# EAGLE schematic Keyboard (EAGLE 6.3)
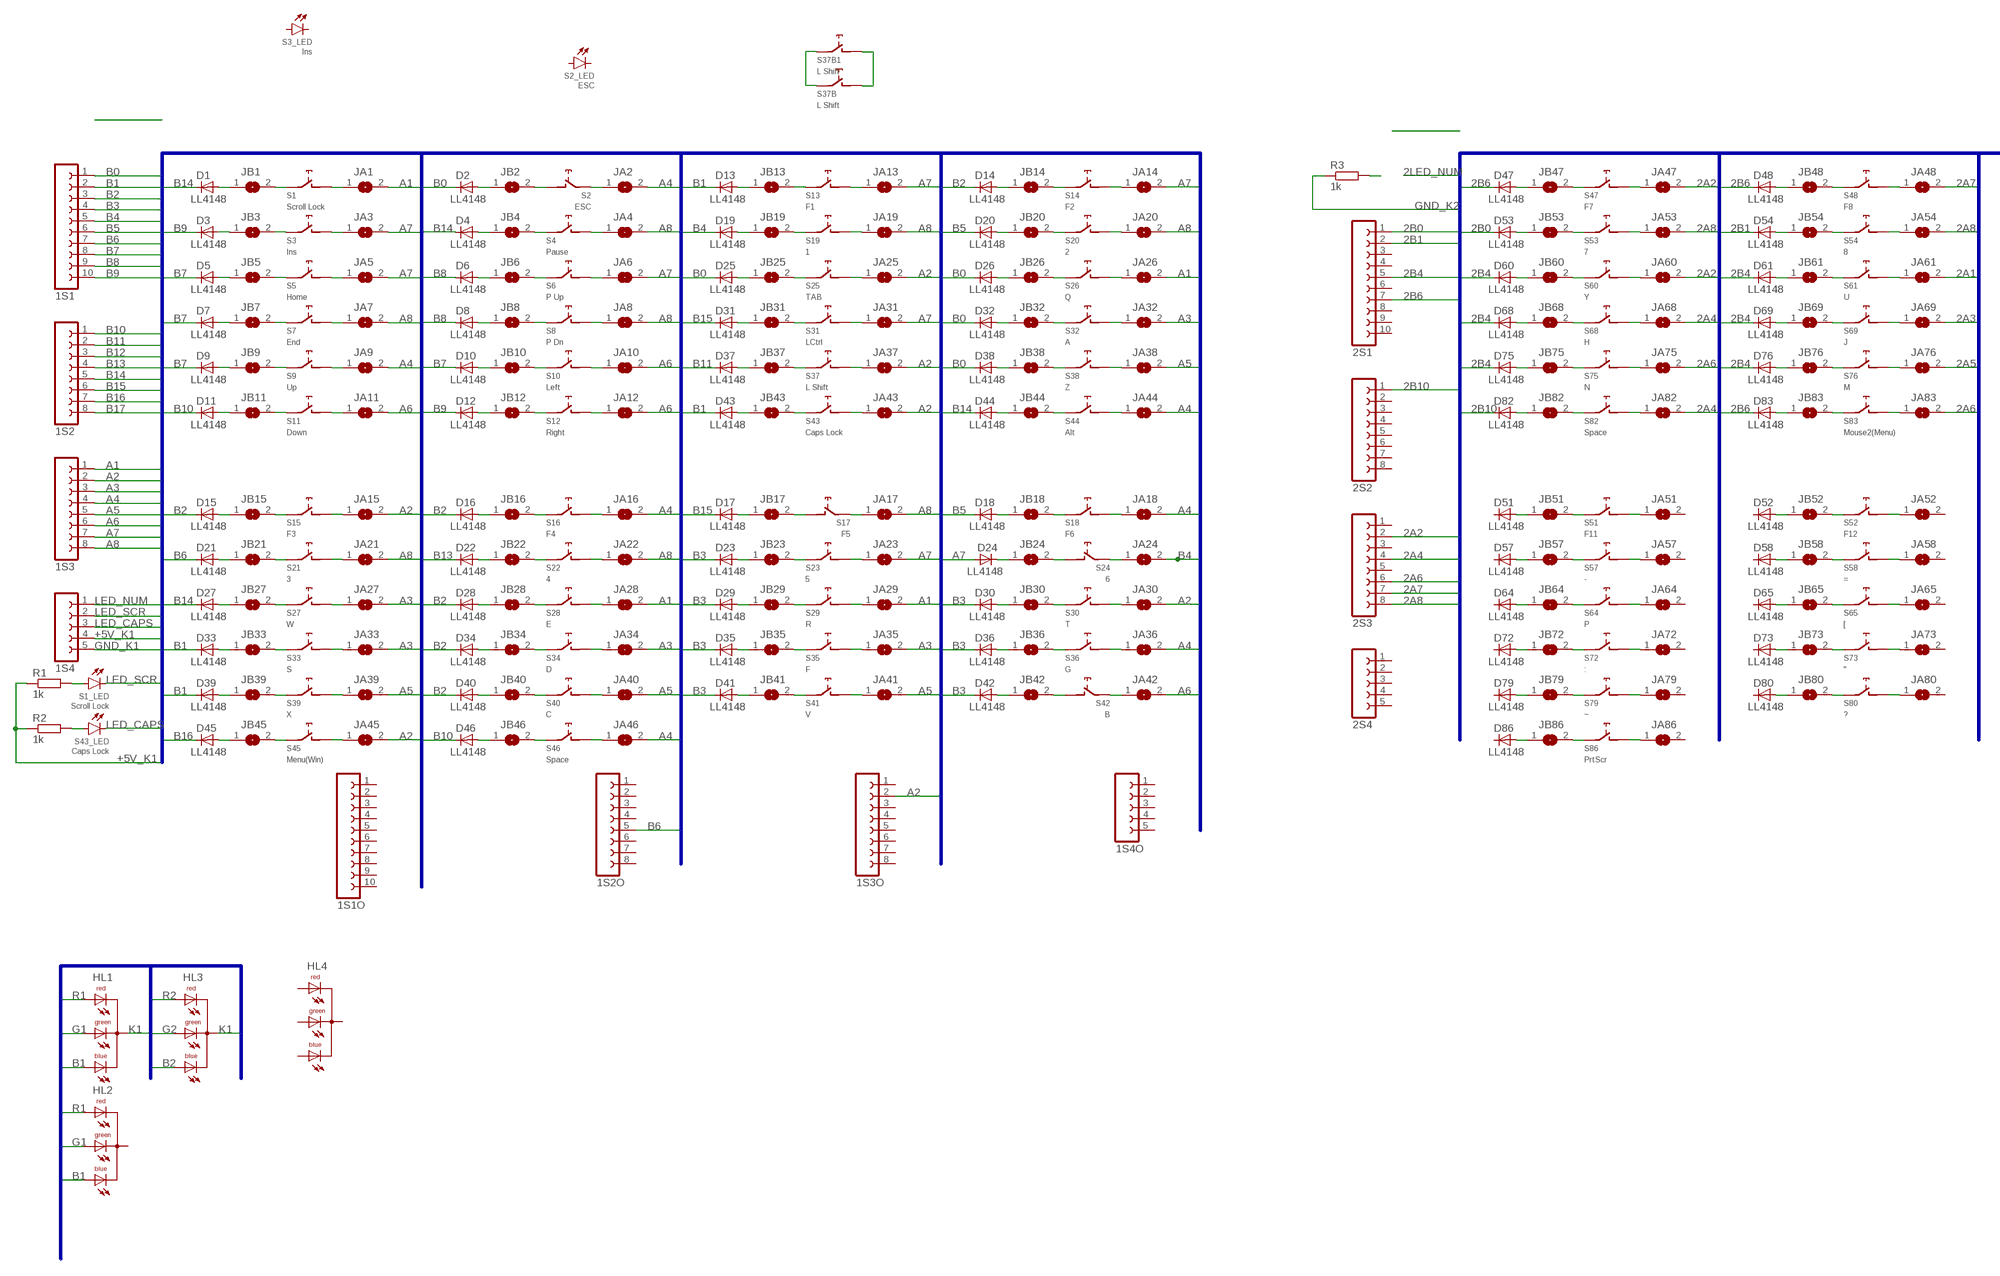
[diagram p0: schematic, sheet 1, part 1 of 2]
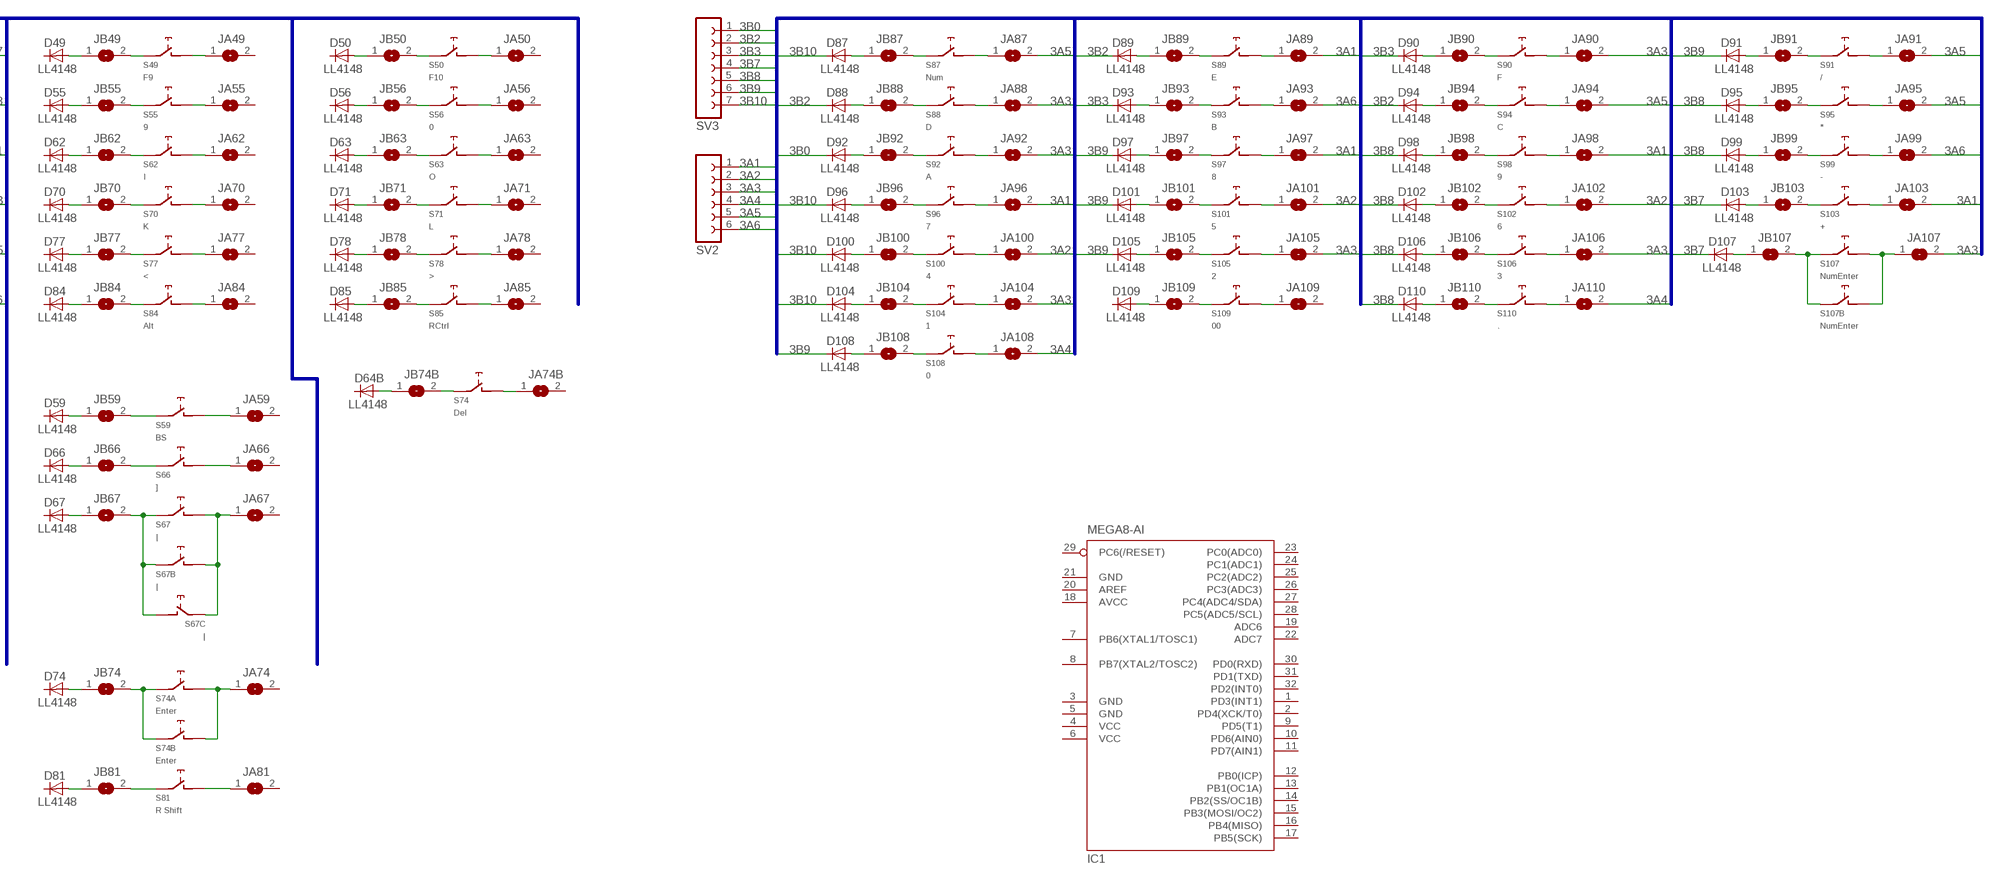
[diagram p1: schematic, sheet 1, part 2 of 2]

## Parts
1S1  FE10-1  [FE10]
1S1O  FE10-1  [FE10]
1S2  FE08-1  [FE08]
1S2O  FE08-1  [FE08]
1S3  FE08-1  [FE08]
1S3O  FE08-1  [FE08]
1S4  FE05-1  [FE05-1]
1S4O  FE05-1  [FE05-1]
2S1  FE10-1  [FE10]
2S2  FE08-1  [FE08]
2S3  FE08-1  [FE08]
2S4  FE05-1  [FE05-1]
D1  LL4148  [SOD80C]
D2  LL4148  [SOD80C]
D3  LL4148  [SOD80C]
D4  LL4148  [SOD80C]
D5  LL4148  [SOD80C]
D6  LL4148  [SOD80C]
D7  LL4148  [SOD80C]
D8  LL4148  [SOD80C]
D9  LL4148  [SOD80C]
D10  LL4148  [SOD80C]
D11  LL4148  [SOD80C]
D12  LL4148  [SOD80C]
D13  LL4148  [SOD80C]
D14  LL4148  [SOD80C]
D15  LL4148  [SOD80C]
D16  LL4148  [SOD80C]
D17  LL4148  [SOD80C]
D18  LL4148  [SOD80C]
D19  LL4148  [SOD80C]
D20  LL4148  [SOD80C]
D21  LL4148  [SOD80C]
D22  LL4148  [SOD80C]
D23  LL4148  [SOD80C]
D24  LL4148  [SOD80C]
D25  LL4148  [SOD80C]
D26  LL4148  [SOD80C]
D27  LL4148  [SOD80C]
D28  LL4148  [SOD80C]
D29  LL4148  [SOD80C]
D30  LL4148  [SOD80C]
D31  LL4148  [SOD80C]
D32  LL4148  [SOD80C]
D33  LL4148  [SOD80C]
D34  LL4148  [SOD80C]
D35  LL4148  [SOD80C]
D36  LL4148  [SOD80C]
D37  LL4148  [SOD80C]
D38  LL4148  [SOD80C]
D39  LL4148  [SOD80C]
D40  LL4148  [SOD80C]
D41  LL4148  [SOD80C]
D42  LL4148  [SOD80C]
D43  LL4148  [SOD80C]
D44  LL4148  [SOD80C]
D45  LL4148  [SOD80C]
D46  LL4148  [SOD80C]
D47  LL4148  [SOD80C]
D48  LL4148  [SOD80C]
D49  LL4148  [SOD80C]
D50  LL4148  [SOD80C]
D51  LL4148  [SOD80C]
D52  LL4148  [SOD80C]
D53  LL4148  [SOD80C]
D54  LL4148  [SOD80C]
D55  LL4148  [SOD80C]
D56  LL4148  [SOD80C]
D57  LL4148  [SOD80C]
D58  LL4148  [SOD80C]
D59  LL4148  [SOD80C]
D60  LL4148  [SOD80C]
D61  LL4148  [SOD80C]
D62  LL4148  [SOD80C]
D63  LL4148  [SOD80C]
D64  LL4148  [SOD80C]
D64B  LL4148  [SOD80C]
D65  LL4148  [SOD80C]
D66  LL4148  [SOD80C]
D67  LL4148  [SOD80C]
D68  LL4148  [SOD80C]
D69  LL4148  [SOD80C]
D70  LL4148  [SOD80C]
D71  LL4148  [SOD80C]
D72  LL4148  [SOD80C]
D73  LL4148  [SOD80C]
D74  LL4148  [SOD80C]
D75  LL4148  [SOD80C]
D76  LL4148  [SOD80C]
D77  LL4148  [SOD80C]
D78  LL4148  [SOD80C]
D79  LL4148  [SOD80C]
D80  LL4148  [SOD80C]
D81  LL4148  [SOD80C]
D82  LL4148  [SOD80C]
D83  LL4148  [SOD80C]
D84  LL4148  [SOD80C]
D85  LL4148  [SOD80C]
D86  LL4148  [SOD80C]
D87  LL4148  [SOD80C]
D88  LL4148  [SOD80C]
D89  LL4148  [SOD80C]
D90  LL4148  [SOD80C]
D91  LL4148  [SOD80C]
D92  LL4148  [SOD80C]
D93  LL4148  [SOD80C]
D94  LL4148  [SOD80C]
D95  LL4148  [SOD80C]
D96  LL4148  [SOD80C]
D97  LL4148  [SOD80C]
D98  LL4148  [SOD80C]
D99  LL4148  [SOD80C]
D100  LL4148  [SOD80C]
D101  LL4148  [SOD80C]
D102  LL4148  [SOD80C]
D103  LL4148  [SOD80C]
D104  LL4148  [SOD80C]
D105  LL4148  [SOD80C]
D106  LL4148  [SOD80C]
D107  LL4148  [SOD80C]
D108  LL4148  [SOD80C]
D109  LL4148  [SOD80C]
D110  LL4148  [SOD80C]
HL1  RGB2X5  [RGB2X5]
HL2  RGB2X5  [RGB2X5]
HL3  RGB2X5  [RGB2X5]
HL4  RGB2X5  [RGB2X5]
IC1  MEGA8-AI  [TQFP32-08]
JA1  SJ  [SJ@1]
JA2  SJ  [SJ@1]
JA3  SJ  [SJ@1]
JA4  SJ  [SJ@1]
JA5  SJ  [SJ@1]
JA6  SJ  [SJ@1]
JA7  SJ  [SJ@1]
JA8  SJ  [SJ@1]
JA9  SJ  [SJ@1]
JA10  SJ  [SJ@1]
JA11  SJ  [SJ@1]
JA12  SJ  [SJ@1]
JA13  SJ  [SJ]
JA14  SJ  [SJ]
JA15  SJ  [SJ]
JA16  SJ  [SJ]
JA17  SJ  [SJ]
JA18  SJ  [SJ]
JA19  SJ  [SJ]
JA20  SJ  [SJ]
JA21  SJ  [SJ]
JA22  SJ  [SJ]
JA23  SJ  [SJ]
JA24  SJ  [SJ]
JA25  SJ  [SJ]
JA26  SJ  [SJ]
JA27  SJ  [SJ]
JA28  SJ  [SJ]
JA29  SJ  [SJ]
JA30  SJ  [SJ]
JA31  SJ  [SJ]
JA32  SJ  [SJ]
JA33  SJ  [SJ]
JA34  SJ  [SJ]
JA35  SJ  [SJ]
JA36  SJ  [SJ]
JA37  SJ  [SJ]
JA38  SJ  [SJ]
JA39  SJ  [SJ]
JA40  SJ  [SJ]
JA41  SJ  [SJ]
JA42  SJ  [SJ]
JA43  SJ  [SJ]
JA44  SJ  [SJ]
JA45  SJ  [SJ]
JA46  SJ  [SJ]
JA47  SJ  [SJ]
JA48  SJ  [SJ]
JA49  SJ  [SJ]
JA50  SJ  [SJ]
JA51  SJ  [SJ]
JA52  SJ  [SJ]
JA53  SJ  [SJ]
JA54  SJ  [SJ]
JA55  SJ  [SJ]
JA56  SJ  [SJ]
JA57  SJ  [SJ]
JA58  SJ  [SJ]
JA59  SJ  [SJ]
JA60  SJ  [SJ]
JA61  SJ  [SJ]
JA62  SJ  [SJ]
JA63  SJ  [SJ]
JA64  SJ  [SJ]
JA65  SJ  [SJ]
JA66  SJ  [SJ]
JA67  SJ  [SJ]
JA68  SJ  [SJ]
JA69  SJ  [SJ]
JA70  SJ  [SJ]
JA71  SJ  [SJ]
JA72  SJ  [SJ]
JA73  SJ  [SJ]
JA74  SJ  [SJ]
JA74B  SJ  [SJ]
JA75  SJ  [SJ]
JA76  SJ  [SJ]
JA77  SJ  [SJ]
JA78  SJ  [SJ]
JA79  SJ  [SJ]
JA80  SJ  [SJ]
JA81  SJ  [SJ]
JA82  SJ  [SJ]
JA83  SJ  [SJ]
JA84  SJ  [SJ]
JA85  SJ  [SJ]
JA86  SJ  [SJ]
JA87  SJ  [SJ]
JA88  SJ  [SJ]
JA89  SJ  [SJ]
JA90  SJ  [SJ]
JA91  SJ  [SJ]
JA92  SJ  [SJ]
JA93  SJ  [SJ]
JA94  SJ  [SJ]
JA95  SJ  [SJ]
JA96  SJ  [SJ]
JA97  SJ  [SJ]
JA98  SJ  [SJ]
JA99  SJ  [SJ]
JA100  SJ  [SJ]
JA101  SJ  [SJ]
JA102  SJ  [SJ]
JA103  SJ  [SJ]
JA104  SJ  [SJ]
JA105  SJ  [SJ]
JA106  SJ  [SJ]
JA107  SJ  [SJ]
JA108  SJ  [SJ]
JA109  SJ  [SJ]
JA110  SJ  [SJ]
JB1  SJ  [SJ]
JB2  SJ  [SJ@1]
JB3  SJ  [SJ]
JB4  SJ  [SJ@1]
JB5  SJ  [SJ@1]
JB6  SJ  [SJ@1]
JB7  SJ  [SJ@1]
JB8  SJ  [SJ@1]
JB9  SJ  [SJ@1]
JB10  SJ  [SJ@1]
JB11  SJ  [SJ@1]
JB12  SJ  [SJ@1]
JB13  SJ  [SJ@1]
JB14  SJ  [SJ@1]
JB15  SJ  [SJ@1]
JB16  SJ  [SJ@1]
JB17  SJ  [SJ@1]
JB18  SJ  [SJ]
JB19  SJ  [SJ]
JB20  SJ  [SJ]
JB21  SJ  [SJ]
JB22  SJ  [SJ]
JB23  SJ  [SJ]
JB24  SJ  [SJ]
JB25  SJ  [SJ]
JB26  SJ  [SJ]
JB27  SJ  [SJ]
JB28  SJ  [SJ]
JB29  SJ  [SJ]
JB30  SJ  [SJ]
JB31  SJ  [SJ]
JB32  SJ  [SJ]
JB33  SJ  [SJ]
JB34  SJ  [SJ]
JB35  SJ  [SJ]
JB36  SJ  [SJ]
JB37  SJ  [SJ]
JB38  SJ  [SJ]
JB39  SJ  [SJ]
JB40  SJ  [SJ]
JB41  SJ  [SJ]
JB42  SJ  [SJ]
JB43  SJ  [SJ]
JB44  SJ  [SJ]
JB45  SJ  [SJ]
JB46  SJ  [SJ]
JB47  SJ  [SJ]
JB48  SJ  [SJ]
JB49  SJ  [SJ]
JB50  SJ  [SJ]
JB51  SJ  [SJ]
JB52  SJ  [SJ]
JB53  SJ  [SJ]
JB54  SJ  [SJ]
JB55  SJ  [SJ]
JB56  SJ  [SJ]
JB57  SJ  [SJ]
JB58  SJ  [SJ]
JB59  SJ  [SJ]
JB60  SJ  [SJ]
JB61  SJ  [SJ]
JB62  SJ  [SJ]
JB63  SJ  [SJ]
JB64  SJ  [SJ]
JB65  SJ  [SJ]
JB66  SJ  [SJ]
JB67  SJ  [SJ]
JB68  SJ  [SJ]
JB69  SJ  [SJ]
JB70  SJ  [SJ]
JB71  SJ  [SJ]
JB72  SJ  [SJ]
JB73  SJ  [SJ]
JB74  SJ  [SJ]
JB74B  SJ  [SJ]
JB75  SJ  [SJ]
JB76  SJ  [SJ]
JB77  SJ  [SJ]
JB78  SJ  [SJ]
JB79  SJ  [SJ]
JB80  SJ  [SJ]
JB81  SJ  [SJ]
JB82  SJ  [SJ]
JB83  SJ  [SJ]
JB84  SJ  [SJ]
JB85  SJ  [SJ]
JB86  SJ  [SJ]
JB87  SJ  [SJ]
JB88  SJ  [SJ]
JB89  SJ  [SJ]
JB90  SJ  [SJ]
JB91  SJ  [SJ]
JB92  SJ  [SJ]
JB93  SJ  [SJ]
JB94  SJ  [SJ]
JB95  SJ  [SJ]
JB96  SJ  [SJ]
JB97  SJ  [SJ]
JB98  SJ  [SJ]
JB99  SJ  [SJ]
JB100  SJ  [SJ]
JB101  SJ  [SJ]
JB102  SJ  [SJ]
JB103  SJ  [SJ]
JB104  SJ  [SJ]
JB105  SJ  [SJ]
JB106  SJ  [SJ]
JB107  SJ  [SJ]
JB108  SJ  [SJ]
JB109  SJ  [SJ]
JB110  SJ  [SJ]
R1  1k  R-EU_R1206W  [R1206W]
R2  1k  R-EU_R1206W  [R1206W]
R3  1k  R-EU_R0805  [R0805]
S1  Scroll Lock  CHERRY-MX-LED  [CHERRY-MX-LED]
S2  ESC  CHERRY-MX-LED  [CHERRY-MX-LED]
S3  Ins  CHERRY-MX-LED  [CHERRY-MX-LED]
S4  Pause  CHERRY_MX  [CHERRY-MX@1]
S5  Home  CHERRY-MX  [CHERRY-MX]
S6  P Up  CHERRY-MX  [CHERRY-MX]
S7  End  CHERRY-MX  [CHERRY-MX]
S8  P Dn  CHERRY-MX  [CHERRY-MX]
S9  Up  CHERRY-MX  [CHERRY-MX]
S10  Left  CHERRY-MX  [CHERRY-MX]
S11  Down  CHERRY-MX  [CHERRY-MX]
S12  Right  CHERRY-MX  [CHERRY-MX]
S13  F1  CHERRY-MX  [CHERRY-MX]
S14  F2  CHERRY-MX  [CHERRY-MX]
S15  F3  CHERRY-MX  [CHERRY-MX]
S16  F4  CHERRY-MX  [CHERRY-MX]
S17  F5  CHERRY-MX  [CHERRY-MX]
S18  F6  CHERRY-MX  [CHERRY-MX]
S19  1  CHERRY-MX  [CHERRY-MX]
S20  2  CHERRY-MX  [CHERRY-MX]
S21  3  CHERRY-MX  [CHERRY-MX]
S22  4  CHERRY-MX  [CHERRY-MX]
S23  5  CHERRY-MX  [CHERRY-MX]
S24  6  CHERRY-MX  [CHERRY-MX]
S25  TAB  CHERRY-MX  [CHERRY-MX]
S26  Q  CHERRY-MX  [CHERRY-MX]
S27  W  CHERRY_MX  [CHERRY-MX@1]
S28  E  CHERRY-MX  [CHERRY-MX]
S29  R  CHERRY-MX  [CHERRY-MX]
S30  T  CHERRY-MX  [CHERRY-MX]
S31  LCtrl  CHERRY-MX  [CHERRY-MX]
S32  A  CHERRY-MX  [CHERRY-MX]
S33  S  CHERRY-MX  [CHERRY-MX]
S34  D  CHERRY-MX  [CHERRY-MX]
S35  F  CHERRY-MX  [CHERRY-MX]
S36  G  CHERRY-MX  [CHERRY-MX]
S37  L Shift  CHERRY-MX  [CHERRY-MX]
S37B  L Shift  CHERRY-MX  [CHERRY-MX]
S37B1  L Shift  CHERRY-MX  [CHERRY-MX]
S38  Z  CHERRY-MX  [CHERRY-MX]
S39  X  CHERRY-MX  [CHERRY-MX]
S40  C  CHERRY-MX  [CHERRY-MX]
S41  V  CHERRY-MX  [CHERRY-MX]
S42  B  CHERRY-MX  [CHERRY-MX]
S43  Caps Lock  CHERRY-MX-LED  [CHERRY-MX-LED]
S44  Alt  CHERRY-MX  [CHERRY-MX]
S45  Menu(Win)  CHERRY-MX  [CHERRY-MX]
S46  Space  CHERRY-MX  [CHERRY-MX]
S47  F7  CHERRY-MX  [CHERRY-MX]
S48  F8  CHERRY-MX  [CHERRY-MX]
S49  F9  CHERRY-MX  [CHERRY-MX]
S50  F10  CHERRY-MX  [CHERRY-MX]
S51  F11  CHERRY-MX  [CHERRY-MX]
S52  F12  CHERRY-MX  [CHERRY-MX]
S53  7  CHERRY-MX  [CHERRY-MX]
S54  8  CHERRY-MX  [CHERRY-MX]
S55  9  CHERRY-MX  [CHERRY-MX]
S56  0  CHERRY-MX  [CHERRY-MX]
S57  -  CHERRY-MX  [CHERRY-MX]
S58  =  CHERRY-MX  [CHERRY-MX]
S59  BS  CHERRY-MX  [CHERRY-MX]
S60  Y  CHERRY-MX  [CHERRY-MX]
S61  U  CHERRY-MX  [CHERRY-MX]
S62  I  CHERRY-MX  [CHERRY-MX]
S63  O  CHERRY-MX  [CHERRY-MX]
S64  P  CHERRY-MX  [CHERRY-MX]
S65  [  CHERRY-MX  [CHERRY-MX]
S66  ]  CHERRY-MX  [CHERRY-MX]
S67  |  CHERRY-MX  [CHERRY-MX]
S67B  |  CHERRY-MX  [CHERRY-MX]
S67C  |  CHERRY-MX  [CHERRY-MX]
S68  H  CHERRY-MX  [CHERRY-MX]
S69  J  CHERRY-MX  [CHERRY-MX]
S70  K  CHERRY-MX  [CHERRY-MX]
S71  L  CHERRY-MX  [CHERRY-MX]
S72  :  CHERRY-MX  [CHERRY-MX]
S73  "  CHERRY-MX  [CHERRY-MX]
S74  Del  CHERRY-MX  [CHERRY-MX]
S74A  Enter  CHERRY-MX  [CHERRY-MX]
S74B  Enter  CHERRY-MX  [CHERRY-MX]
S75  N  CHERRY-MX  [CHERRY-MX]
S76  M  CHERRY-MX  [CHERRY-MX]
S77  <  CHERRY-MX  [CHERRY-MX]
S78  >  CHERRY-MX  [CHERRY-MX]
S79  ~  CHERRY-MX  [CHERRY-MX]
S80  ?  CHERRY-MX  [CHERRY-MX]
S81  R Shift  CHERRY-MX  [CHERRY-MX]
S82  Space  CHERRY-MX  [CHERRY-MX]
S83  Mouse2(Menu)  CHERRY-MX  [CHERRY-MX]
S84  Alt  CHERRY-MX  [CHERRY-MX]
S85  RCtrl  CHERRY-MX  [CHERRY-MX]
S86  PrtScr  CHERRY-MX  [CHERRY-MX]
S87  Num  CHERRY-MX-4P  [CHERRY-MX-4P]
S88  D  CHERRY-MX-4P  [CHERRY-MX-4P]
S89  E  CHERRY-MX-4P  [CHERRY-MX-4P]
S90  F  CHERRY-MX-4P  [CHERRY-MX-4P]
S91  /  CHERRY-MX-4P  [CHERRY-MX-4P]
S92  A  CHERRY-MX-4P  [CHERRY-MX-4P]
S93  B  CHERRY-MX-4P  [CHERRY-MX-4P]
S94  C  CHERRY-MX-4P  [CHERRY-MX-4P]
S95  *  CHERRY-MX-4P  [CHERRY-MX-4P]
S96  7  CHERRY-MX-4P  [CHERRY-MX-4P]
S97  8  CHERRY-MX-4P  [CHERRY-MX-4P]
S98  9  CHERRY-MX-4P  [CHERRY-MX-4P]
S99  -  CHERRY-MX-4P  [CHERRY-MX-4P]
S100  4  CHERRY-MX-4P  [CHERRY-MX-4P]
S101  5  CHERRY-MX-4P  [CHERRY-MX-4P]
S102  6  CHERRY-MX-4P  [CHERRY-MX-4P]
S103  +  CHERRY-MX-4P  [CHERRY-MX-4P]
S104  1  CHERRY-MX-4P  [CHERRY-MX-4P]
S105  2  CHERRY-MX-4P  [CHERRY-MX-4P]
S106  3  CHERRY-MX-4P  [CHERRY-MX-4P]
S107  NumEnter  CHERRY-MX-4P  [CHERRY-MX-4P]
S107B  NumEnter  CHERRY-MX  [CHERRY-MX]
S108  0  CHERRY-MX-4P  [CHERRY-MX-4P]
S109  00  CHERRY-MX-4P  [CHERRY-MX-4P]
S110  .  CHERRY-MX-4P  [CHERRY-MX-4P]
SV2  FE06-1  [FE06]
SV3  FE07-1  [FE07]

## Nets
2A1: JA61.2
2A2: 2S3.2 JA47.2 JA60.2
2A3: JA69.2
2A4: 2S3.4 JA68.2 JA82.2
2A5: JA76.2
2A6: 2S3.6 JA75.2 JA83.2
2A7: 2S3.7 JA48.2
2A8: 2S3.8 JA53.2 JA54.2
2B0: 2S1.1 D53.C
2B1: 2S1.2 D54.C
2B4: 2S1.5 D60.C D61.C D68.C D69.C D75.C D76.C
2B6: 2S1.7 D47.C D48.C D83.C
2B10: 2S2.1 D82.C
3A1: JA89.2 JA96.2 JA97.2 JA98.2 JA103.2 SV2.1
3A2: JA100.2 JA101.2 JA102.2 SV2.2
3A3: JA88.2 JA90.2 JA92.2 JA104.2 JA105.2 JA106.2 JA107.2 SV2.3
3A4: JA108.2 JA110.2 SV2.4
3A5: JA87.2 JA91.2 JA94.2 JA95.2 SV2.5
3A6: JA93.2 JA99.2 SV2.6
3B0: D92.C SV3.1
3B2: D88.C D89.C D94.C SV3.2
3B3: D90.C D93.C SV3.3
3B7: D103.C D107.C SV3.4
3B8: D95.C D98.C D99.C D102.C D106.C D110.C SV3.5
3B9: D91.C D97.C D101.C D105.C D108.C SV3.6
3B10: D87.C D96.C D100.C D104.C SV3.7
+5V_K1: 1S4.4 R1.1 R2.1
A1: 1S3.1 JA1.2 JA26.2 JA28.2 JA29.2
A2: 1S3.2 1S3O.2 JA15.2 JA25.2 JA30.2 JA37.2 JA43.2 JA45.2
A3: 1S3.3 JA27.2 JA32.2 JA33.2 JA34.2 JA35.2
A4: 1S3.4 JA2.2 JA9.2 JA16.2 JA18.2 JA36.2 JA44.2 JA46.2
A5: 1S3.5 JA38.2 JA39.2 JA40.2 JA41.2
A6: 1S3.6 JA10.2 JA11.2 JA12.2 JA42.2
A7: 1S3.7 D24.A JA3.2 JA5.2 JA6.2 JA13.2 JA14.2 JA23.2 JA31.2
A8: 1S3.8 JA4.2 JA7.2 JA8.2 JA17.2 JA19.2 JA20.2 JA21.2 JA22.2
B0: 1S1.1 D2.C D25.C D26.C D32.C D38.C
B1: 1S1.2 D13.C D33.C D39.C D43.C HL1.4(AB) HL2.4(AB)
B2: 1S1.3 D14.C D15.C D16.C D28.C D34.C D40.C HL3.4(AB)
B3: 1S1.4 D23.C D29.C D30.C D35.C D36.C D41.C D42.C
B4: 1S1.5 D19.C JA24.2
B5: 1S1.6 D18.C D20.C
B6: 1S1.7 1S2O.5 D21.C
B7: 1S1.8 D5.C D7.C D9.C D10.C
B8: 1S1.9 D6.C D8.C
B9: 1S1.10 D3.C D12.C
B10: 1S2.1 D11.C D46.C
B11: 1S2.2 D37.C
B12: 1S2.3
B13: 1S2.4 D22.C
B14: 1S2.5 D1.C D4.C D27.C D44.C
B15: 1S2.6 D17.C D31.C
B16: 1S2.7 D45.C
B17: 1S2.8
G1: HL1.3(AG) HL2.3(AG)
G2: HL3.3(AG)
GND_K1: 1S4.5
GND_K2: R3.1
K1: HL1.2(C) HL3.2(C)
LED_CAPS: 1S4.3 S43.LED2(_LED:LED2)
LED_NUM: 1S4.1
LED_SCR: 1S4.2 S1.LED2(_LED:LED2)
N$1: D15.A JB15.1
N$2: JB4.2 S4.SW1(PIN-1)
N$3: D1.A JB1.1
N$4: JA4.1 S4.SW2(PIN-2)
N$5: JB14.2 S14.SW1(PIN-1)
N$6: JB20.2 S20.SW1(PIN-1)
N$7: JB32.2 S32.SW1(PIN-1)
N$8: JB38.2 S38.SW1(PIN-1)
N$9: JB6.2 S6.SW1(PIN-1)
N$10: JA6.1 S6.SW2(PIN-2)
N$11: JA8.1 S8.SW2(PIN-2)
N$12: JB8.2 S8.SW1(PIN-1)
N$13: JB10.2 S10.SW1(PIN-1)
N$14: JB1.2 S1.SW1(PIN-1)
N$15: D2.A JB2.1
N$16: JB2.2 S2.SW2(PIN-2)
N$17: JA2.1 S2.SW1(PIN-1)
N$18: D16.A JB16.1
N$19: JB3.2 S3.SW1(PIN-1)
N$20: JB5.2 S5.SW1(PIN-1)
N$21: JB7.2 S7.SW1(PIN-1)
N$22: JB9.2 S9.SW1(PIN-1)
N$23: JB11.2 S11.SW1(PIN-1)
N$24: D3.A JB3.1
N$25: JB12.2 S12.SW1(PIN-1)
N$26: D5.A JB5.1
N$27: D7.A JB7.1
N$28: JA10.1 S10.SW2(PIN-2)
N$29: JA1.1 S1.SW2(PIN-2)
N$30: D9.A JB9.1
N$31: D11.A JB11.1
N$32: JA3.1 S3.SW2(PIN-2)
N$33: JA5.1 S5.SW2(PIN-2)
N$34: JA7.1 S7.SW2(PIN-2)
N$35: JA9.1 S9.SW2(PIN-2)
N$36: JA11.1 S11.SW2(PIN-2)
N$37: JA12.1 S12.SW2(PIN-2)
N$38: JA14.1 S14.SW2(PIN-2)
N$39: JB13.2 S13.SW1(PIN-1)
N$40: JA13.1 S13.SW2(PIN-2)
N$41: D14.A JB14.1
N$42: JB42.2 S42.SW2(PIN-2)
N$43: JA42.1 S42.SW1(PIN-1)
N$44: JB27.2 S27.SW1(PIN-1)
N$45: JA27.1 S27.SW2(PIN-2)
N$46: JB17.2 S17.SW2(PIN-2)
N$47: JA17.1 S17.SW1(PIN-1)
N$48: D24.C JB24.1
N$49: JB24.2 S24.SW2(PIN-2)
N$50: JA24.1 S24.SW1(PIN-1)
N$51: JA107.1 S107.SW2(PIN-2) S107B.SW2(PIN-2)
N$52: D4.A JB4.1
N$53: D6.A JB6.1
N$54: D8.A JB8.1
N$55: D10.A JB10.1
N$56: D12.A JB12.1
N$57: D13.A JB13.1
N$58: JB19.2 S19.SW1(PIN-1)
N$59: JB25.2 S25.SW1(PIN-1)
N$60: D104.A JB104.1
N$61: JB31.2 S31.SW1(PIN-1)
N$62: JB37.2 S37.SW1(PIN-1) S37B1.SW1(PIN-1) S37B.SW1(PIN-1)
N$63: JB43.2 S43.SW1(PIN-1)
N$64: JB26.2 S26.SW1(PIN-1)
N$65: JB44.2 S44.SW1(PIN-1)
N$66: JB18.2 S18.SW1(PIN-1)
N$68: JB30.2 S30.SW1(PIN-1)
N$69: JB36.2 S36.SW1(PIN-1)
N$70: JB74B.2 S74.SW1(PIN-1)
N$71: JB52.2 S52.SW1(PIN-1)
N$72: JB23.2 S23.SW1(PIN-1)
N$73: JB29.2 S29.SW1(PIN-1)
N$74: JB35.2 S35.SW1(PIN-1)
N$75: JB41.2 S41.SW1(PIN-1)
N$76: JB16.2 S16.SW1(PIN-1)
N$77: JB22.2 S22.SW1(PIN-1)
N$78: JB28.2 S28.SW1(PIN-1)
N$79: JB34.2 S34.SW1(PIN-1)
N$80: JB40.2 S40.SW1(PIN-1)
N$81: JB46.2 S46.SW1(PIN-1)
N$82: JB15.2 S15.SW1(PIN-1)
N$83: JB21.2 S21.SW1(PIN-1)
N$84: JB63.2 S63.SW1(PIN-1)
N$85: JB33.2 S33.SW1(PIN-1)
N$86: JB39.2 S39.SW1(PIN-1)
N$87: JB45.2 S45.SW1(PIN-1)
N$88: JA15.1 S15.SW2(PIN-2)
N$89: JB73.2 S73.SW1(PIN-1)
N$90: JA18.1 S18.SW2(PIN-2)
N$91: JA20.1 S20.SW2(PIN-2)
N$92: JA22.1 S22.SW2(PIN-2)
N$93: JA23.1 S23.SW2(PIN-2)
N$94: JB74.2 S74A.SW1(PIN-1) S74B.SW1(PIN-1)
N$95: JA25.1 S25.SW2(PIN-2)
N$96: JA26.1 S26.SW2(PIN-2)
N$97: JA74.1 S74A.SW2(PIN-2) S74B.SW2(PIN-2)
N$98: JA28.1 S28.SW2(PIN-2)
N$99: JA29.1 S29.SW2(PIN-2)
N$100: JA30.1 S30.SW2(PIN-2)
N$101: JA31.1 S31.SW2(PIN-2)
N$102: JA32.1 S32.SW2(PIN-2)
N$103: JA33.1 S33.SW2(PIN-2)
N$104: JA34.1 S34.SW2(PIN-2)
N$105: JA35.1 S35.SW2(PIN-2)
N$106: JA36.1 S36.SW2(PIN-2)
N$107: JA37.1 S37.SW2(PIN-2) S37B1.SW2(PIN-2) S37B.SW2(PIN-2)
N$108: JA38.1 S38.SW2(PIN-2)
N$109: JA39.1 S39.SW2(PIN-2)
N$110: JA40.1 S40.SW2(PIN-2)
N$111: JA41.1 S41.SW2(PIN-2)
N$112: JB47.2 S47.SW1(PIN-1)
N$113: JA43.1 S43.SW2(PIN-2)
N$114: JA45.1 S45.SW2(PIN-2)
N$115: JA46.1 S46.SW2(PIN-2)
N$116: JA19.1 S19.SW2(PIN-2)
N$117: JA44.1 S44.SW2(PIN-2)
N$118: JA21.1 S21.SW2(PIN-2)
N$119: JA16.1 S16.SW2(PIN-2)
N$120: D17.A JB17.1
N$121: D18.A JB18.1
N$122: D19.A JB19.1
N$123: D20.A JB20.1
N$124: D21.A JB21.1
N$125: D22.A JB22.1
N$126: D23.A JB23.1
N$127: JB53.2 S53.SW1(PIN-1)
N$128: D25.A JB25.1
N$129: D26.A JB26.1
N$130: D27.A JB27.1
N$131: D28.A JB28.1
N$132: D29.A JB29.1
N$133: D30.A JB30.1
N$134: D31.A JB31.1
N$135: D32.A JB32.1
N$136: D33.A JB33.1
N$137: D34.A JB34.1
N$138: D35.A JB35.1
N$139: D36.A JB36.1
N$140: D37.A JB37.1
N$141: D38.A JB38.1
N$142: D39.A JB39.1
N$143: D40.A JB40.1
N$144: D41.A JB41.1
N$145: D42.A JB42.1
N$146: D43.A JB43.1
N$147: D44.A JB44.1
N$148: D45.A JB45.1
N$149: D46.A JB46.1
N$150: R1.2 S1.LED1(_LED:LED1)
N$151: R2.2 S43.LED1(_LED:LED1)
N$152: R3.2
N$153: JB60.2 S60.SW1(PIN-1)
N$154: JB68.2 S68.SW1(PIN-1)
N$155: JB75.2 S75.SW1(PIN-1)
N$156: JB82.2 S82.SW1(PIN-1)
N$157: JB48.2 S48.SW1(PIN-1)
N$158: JB54.2 S54.SW1(PIN-1)
N$159: JB61.2 S61.SW1(PIN-1)
N$160: JB69.2 S69.SW1(PIN-1)
N$161: JB76.2 S76.SW1(PIN-1)
N$162: JB83.2 S83.SW1(PIN-1)
N$163: JB49.2 S49.SW1(PIN-1)
N$164: JB55.2 S55.SW1(PIN-1)
N$165: JB62.2 S62.SW1(PIN-1)
N$166: JB70.2 S70.SW1(PIN-1)
N$167: JB77.2 S77.SW1(PIN-1)
N$168: JB84.2 S84.SW1(PIN-1)
N$169: JB50.2 S50.SW1(PIN-1)
N$170: JB56.2 S56.SW1(PIN-1)
N$171: JB71.2 S71.SW1(PIN-1)
N$172: JB78.2 S78.SW1(PIN-1)
N$173: JB85.2 S85.SW1(PIN-1)
N$174: JB51.2 S51.SW1(PIN-1)
N$175: JB57.2 S57.SW1(PIN-1)
N$176: JB64.2 S64.SW1(PIN-1)
N$177: JB72.2 S72.SW1(PIN-1)
N$178: JB79.2 S79.SW1(PIN-1)
N$179: JB86.2 S86.SW1(PIN-1)
N$180: JB58.2 S58.SW1(PIN-1)
N$181: JB65.2 S65.SW1(PIN-1)
N$182: JB80.2 S80.SW1(PIN-1)
N$183: JB59.2 S59.SW1(PIN-1)
N$184: JB66.2 S66.SW1(PIN-1)
N$185: JB67.2 S67.SW1(PIN-1) S67B.SW1(PIN-1) S67C.SW2(PIN-2)
N$186: JB81.2 S81.SW1(PIN-1)
N$187: D47.A JB47.1
N$188: D53.A JB53.1
N$189: D60.A JB60.1
N$190: D68.A JB68.1
N$191: D75.A JB75.1
N$192: D82.A JB82.1
N$193: D48.A JB48.1
N$194: D54.A JB54.1
N$195: D61.A JB61.1
N$196: D69.A JB69.1
N$197: D76.A JB76.1
N$198: D83.A JB83.1
N$199: D49.A JB49.1
N$200: D55.A JB55.1
N$201: D62.A JB62.1
N$202: D70.A JB70.1
N$203: D77.A JB77.1
N$204: D84.A JB84.1
N$205: D50.A JB50.1
N$206: D56.A JB56.1
N$207: D63.A JB63.1
N$208: D71.A JB71.1
N$209: D78.A JB78.1
N$210: D85.A JB85.1
N$211: D51.A JB51.1
N$212: D57.A JB57.1
N$213: D64.A JB64.1
N$214: D72.A JB72.1
N$215: D79.A JB79.1
N$216: D86.A JB86.1
N$217: D52.A JB52.1
N$218: D58.A JB58.1
N$219: D65.A JB65.1
N$220: D73.A JB73.1
N$221: D80.A JB80.1
N$222: D59.A JB59.1
N$223: D66.A JB66.1
N$224: D67.A JB67.1
N$225: D74.A JB74.1
N$226: D81.A JB81.1
N$227: JA66.1 S66.SW2(PIN-2)
N$228: JA47.1 S47.SW2(PIN-2)
N$229: JA53.1 S53.SW2(PIN-2)
N$230: JA60.1 S60.SW2(PIN-2)
N$231: JA68.1 S68.SW2(PIN-2)
N$232: JA75.1 S75.SW2(PIN-2)
N$233: JA82.1 S82.SW2(PIN-2)
N$234: JA48.1 S48.SW2(PIN-2)
N$235: JA54.1 S54.SW2(PIN-2)
N$236: JA61.1 S61.SW2(PIN-2)
N$237: JA69.1 S69.SW2(PIN-2)
N$238: JA76.1 S76.SW2(PIN-2)
N$239: JA83.1 S83.SW2(PIN-2)
N$240: JA49.1 S49.SW2(PIN-2)
N$241: JA55.1 S55.SW2(PIN-2)
N$242: JA62.1 S62.SW2(PIN-2)
N$243: JA70.1 S70.SW2(PIN-2)
N$244: JA77.1 S77.SW2(PIN-2)
N$245: JA84.1 S84.SW2(PIN-2)
N$246: JA50.1 S50.SW2(PIN-2)
N$247: JA56.1 S56.SW2(PIN-2)
N$248: JA63.1 S63.SW2(PIN-2)
N$249: JA71.1 S71.SW2(PIN-2)
N$250: JA78.1 S78.SW2(PIN-2)
N$251: JA85.1 S85.SW2(PIN-2)
N$252: JA51.1 S51.SW2(PIN-2)
N$253: JA57.1 S57.SW2(PIN-2)
N$254: JA64.1 S64.SW2(PIN-2)
N$255: JA72.1 S72.SW2(PIN-2)
N$256: JA79.1 S79.SW2(PIN-2)
N$257: JA86.1 S86.SW2(PIN-2)
N$258: JA52.1 S52.SW2(PIN-2)
N$259: JA58.1 S58.SW2(PIN-2)
N$260: JA65.1 S65.SW2(PIN-2)
N$261: JA73.1 S73.SW2(PIN-2)
N$262: JA80.1 S80.SW2(PIN-2)
N$263: JA81.1 S81.SW2(PIN-2)
N$264: JA67.1 S67.SW2(PIN-2) S67B.SW2(PIN-2) S67C.SW1(PIN-1)
N$265: JA59.1 S59.SW2(PIN-2)
N$266: D64B.A JB74B.1
N$267: JA74B.1 S74.SW2(PIN-2)
N$268: D87.A JB87.1
N$269: D88.A JB88.1
N$270: JB87.2 S87.SW1(PIN-1)
N$271: JB88.2 S88.SW1(PIN-1)
N$272: JA87.1 S87.SW2(PIN-2)
N$273: JA88.1 S88.SW2(PIN-2)
N$274: D89.A JB89.1
N$275: JB89.2 S89.SW1(PIN-1)
N$276: JA89.1 S89.SW2(PIN-2)
N$277: D90.A JB90.1
N$278: JB90.2 S90.SW1(PIN-1)
N$279: JA90.1 S90.SW2(PIN-2)
N$280: D91.A JB91.1
N$281: JB91.2 S91.SW1(PIN-1)
N$282: JA91.1 S91.SW2(PIN-2)
N$283: JB92.2 S92.SW1(PIN-1)
N$284: D92.A JB92.1
N$285: JA92.1 S92.SW2(PIN-2)
N$286: JA93.1 S93.SW2(PIN-2)
N$287: JB93.2 S93.SW1(PIN-1)
N$288: D93.A JB93.1
N$289: D94.A JB94.1
N$290: JB94.2 S94.SW1(PIN-1)
N$291: JA94.1 S94.SW2(PIN-2)
N$292: D95.A JB95.1
N$293: JB95.2 S95.SW1(PIN-1)
N$294: JA95.1 S95.SW2(PIN-2)
N$295: D96.A JB96.1
N$296: JB96.2 S96.SW1(PIN-1)
N$297: JA96.1 S96.SW2(PIN-2)
N$298: JB97.2 S97.SW1(PIN-1)
N$299: JA97.1 S97.SW2(PIN-2)
N$300: D97.A JB97.1
N$301: D98.A JB98.1
N$302: JB98.2 S98.SW1(PIN-1)
N$303: JA98.1 S98.SW2(PIN-2)
N$304: D99.A JB99.1
N$305: JB99.2 S99.SW1(PIN-1)
N$306: JA99.1 S99.SW2(PIN-2)
N$307: D100.A JB100.1
N$308: JB100.2 S100.SW1(PIN-1)
N$309: JA100.1 S100.SW2(PIN-2)
N$310: JB101.2 S101.SW1(PIN-1)
N$311: D101.A JB101.1
N$312: JA101.1 S101.SW2(PIN-2)
N$313: D102.A JB102.1
N$314: JB102.2 S102.SW1(PIN-1)
N$315: JA102.1 S102.SW2(PIN-2)
N$316: D103.A JB103.1
N$317: JB103.2 S103.SW1(PIN-1)
N$318: JA103.1 S103.SW2(PIN-2)
N$319: JB107.2 S107.SW1(PIN-1) S107B.SW1(PIN-1)
N$320: JB104.2 S104.SW1(PIN-1)
N$321: JA104.1 S104.SW2(PIN-2)
N$322: JB105.2 S105.SW1(PIN-1)
N$323: D105.A JB105.1
N$324: JA105.1 S105.SW2(PIN-2)
N$325: D106.A JB106.1
N$326: JB106.2 S106.SW1(PIN-1)
N$327: JA106.1 S106.SW2(PIN-2)
N$328: D107.A JB107.1
N$329: JB108.2 S108.SW1(PIN-1)
N$330: JA108.1 S108.SW2(PIN-2)
N$331: D108.A JB108.1
N$332: JB109.2 S109.SW1(PIN-1)
N$333: D109.A JB109.1
N$334: JA109.1 S109.SW2(PIN-2)
N$335: D110.A JB110.1
N$336: JB110.2 S110.SW1(PIN-1)
N$337: JA110.1 S110.SW2(PIN-2)
R1: HL1.1(AR) HL2.1(AR)
R2: HL3.1(AR)
Unconnected: 1S1O.1 1S1O.2 1S1O.3 1S1O.4 1S1O.5 1S1O.6 1S1O.7 1S1O.8 1S1O.9 1S1O.10 1S2O.1 1S2O.2 1S2O.3 1S2O.4 1S2O.6 1S2O.7 1S2O.8 1S3O.1 1S3O.3 1S3O.4 1S3O.5 1S3O.6 1S3O.7 1S3O.8 1S4O.1 1S4O.2 1S4O.3 1S4O.4 1S4O.5 2S1.3 2S1.4 2S1.6 2S1.8 2S1.9 2S1.10 2S2.2 2S2.3 2S2.4 2S2.5 2S2.6 2S2.7 2S2.8 2S3.1 2S3.3 2S3.5 2S4.1 2S4.2 2S4.3 2S4.4 2S4.5 D49.C D50.C D51.C D52.C D55.C D56.C D57.C D58.C D59.C D62.C D63.C D64.C D64B.C D65.C D66.C D67.C D70.C D71.C D72.C D73.C D74.C D77.C D78.C D79.C D80.C D81.C D84.C D85.C D86.C D109.C HL2.2(C) HL4.1(AR) HL4.2(C) HL4.3(AG) HL4.4(AB) IC1.1(PD3(INT1)) IC1.2(PD4(XCK/T0)) IC1.7(PB6(XTAL1/TOSC1)) IC1.8(PB7(XTAL2/TOSC2)) IC1.9(PD5(T1)) IC1.10(PD6(AIN0)) IC1.11(PD7(AIN1)) IC1.12(PB0(ICP)) IC1.13(PB1(OC1A)) IC1.14(PB2(SS/OC1B)) IC1.15(PB3(MOSI/OC2)) IC1.16(PB4(MISO)) IC1.17(PB5(SCK)) IC1.19(ADC6) IC1.20(AREF) IC1.22(ADC7) IC1.23(PC0(ADC0)) IC1.24(PC1(ADC1)) IC1.25(PC2(ADC2)) IC1.26(PC3(ADC3)) IC1.27(PC4(ADC4/SDA)) IC1.28(PC5(ADC5/SCL)) IC1.29(PC6(/RESET)) IC1.30(PD0(RXD)) IC1.31(PD1(TXD)) IC1.32(PD2(INT0)) JA49.2 JA50.2 JA51.2 JA52.2 JA55.2 JA56.2 JA57.2 JA58.2 JA59.2 JA62.2 JA63.2 JA64.2 JA65.2 JA66.2 JA67.2 JA70.2 JA71.2 JA72.2 JA73.2 JA74.2 JA74B.2 JA77.2 JA78.2 JA79.2 JA80.2 JA81.2 JA84.2 JA85.2 JA86.2 JA109.2 S2.LED1(_LED:LED1) S2.LED2(_LED:LED2) S3.LED1(_LED:LED1) S3.LED2(_LED:LED2) S87.D1(_D:D1) S87.D2(_D:D2) S87.LED1(_L:LED1) S87.LED2(_L:LED2) S88.D1(_D:D1) S88.D2(_D:D2) S88.LED1(_L:LED1) S88.LED2(_L:LED2) S89.D1(_D:D1) S89.D2(_D:D2) S89.LED1(_L:LED1) S89.LED2(_L:LED2) S90.D1(_D:D1) S90.D2(_D:D2) S90.LED1(_L:LED1) S90.LED2(_L:LED2) S91.D1(_D:D1) S91.D2(_D:D2) S91.LED1(_L:LED1) S91.LED2(_L:LED2) S92.D1(_D:D1) S92.D2(_D:D2) S92.LED1(_L:LED1) S92.LED2(_L:LED2) S93.D1(_D:D1) S93.D2(_D:D2) S93.LED1(_L:LED1) S93.LED2(_L:LED2) S94.D1(_D:D1) S94.D2(_D:D2) S94.LED1(_L:LED1) S94.LED2(_L:LED2) S95.D1(_D:D1) S95.D2(_D:D2) S95.LED1(_L:LED1) S95.LED2(_L:LED2) S96.D1(_D:D1) S96.D2(_D:D2) S96.LED1(_L:LED1) S96.LED2(_L:LED2) S97.D1(_D:D1) S97.D2(_D:D2) S97.LED1(_L:LED1) S97.LED2(_L:LED2) S98.D1(_D:D1) S98.D2(_D:D2) S98.LED1(_L:LED1) S98.LED2(_L:LED2) S99.D1(_D:D1) S99.D2(_D:D2) S99.LED1(_L:LED1) S99.LED2(_L:LED2) S100.D1(_D:D1) S100.D2(_D:D2) S100.LED1(_L:LED1) S100.LED2(_L:LED2) S101.D1(_D:D1) S101.D2(_D:D2) S101.LED1(_L:LED1) S101.LED2(_L:LED2) S102.D1(_D:D1) S102.D2(_D:D2) S102.LED1(_L:LED1) S102.LED2(_L:LED2) S103.D1(_D:D1) S103.D2(_D:D2) S103.LED1(_L:LED1) S103.LED2(_L:LED2) S104.D1(_D:D1) S104.D2(_D:D2) S104.LED1(_L:LED1) S104.LED2(_L:LED2) S105.D1(_D:D1) S105.D2(_D:D2) S105.LED1(_L:LED1) S105.LED2(_L:LED2) S106.D1(_D:D1) S106.D2(_D:D2) S106.LED1(_L:LED1) S106.LED2(_L:LED2) S107.D1(_D:D1) S107.D2(_D:D2) S107.LED1(_L:LED1) S107.LED2(_L:LED2) S108.D1(_D:D1) S108.D2(_D:D2) S108.LED1(_L:LED1) S108.LED2(_L:LED2) S109.D1(_D:D1) S109.D2(_D:D2) S109.LED1(_L:LED1) S109.LED2(_L:LED2) S110.D1(_D:D1) S110.D2(_D:D2) S110.LED1(_L:LED1) S110.LED2(_L:LED2)

## Buses
A[1..8],B[0..17],LED_NUM,LED_CAPS,LED_SCR,+5V_K1,GND_K1
3A[1..8],3B[0..17],3LED_NUM,3LED_CAPS,3LED_SCR,+5V_K3,GND_K3
R[1..8],G[1..8],B[1..8],K[1..8]

## Power pins joined to a net without a drawn wire
AVCC: IC1.18(AVCC)
GND: IC1.3(GND) IC1.5(GND) IC1.21(GND)
VCC: IC1.4(VCC) IC1.6(VCC)

## Library data of the parts
1S1 1S1O 2S1 = con-lsta:FE10-1: FEMALE HEADER; OC_FARNELL: unknown; OC_NEWARK: unknown
1S2 1S2O 1S3 1S3O 2S2 2S3 = con-lsta:FE08-1: FEMALE HEADER; OC_FARNELL: unknown; OC_NEWARK: unknown
1S4 1S4O 2S4 = con-lsta:FE05-1: FEMALE HEADER; OC_FARNELL: unknown; OC_NEWARK: unknown
D1-D64 D64B D65-D110 = detali:LL4148: DIODE high speed
HL1-HL4 = led:RGB2X5: DUO LED 2 colors, 5 mm, round
IC1 = atmel:MEGA8: MICROCONTROLLER 8 Kbytes FLASH, 1 kbytes SRAM, 512 bytes EEPROM, USART, 6-channel 10 bit ADC, 2-channel 8 bit ADC Pin compatible with Atmega48, ATMega88, ATMega168 Source: avr.lbr; MPN: ATMEGA8-16AU; OC_FARNELL: 9171371; OC_NEWARK: 73M8863
JA1-JA12 JB2 JB4-JB17 = jumper:SJ: SMD solder JUMPER
JA13-JA74 JA74B JA75-JA110 JB1 JB3 JB18-JB74 JB74B JB75-JB110 = detali:SJ: SMD solder JUMPER
R1-R3 = rcl:R-EU_: RESISTOR, European symbol
S1-S3 S43 = cherrymx:CHERRY-MX-LED: Cherry MX series keyswitch with LED
S4 S27 = cherrymx:CHERRY_MX
S5-S26 S28-S37 S37B S37B1 S38-S42 S44-S67 S67B S67C S68-S74 S74A S74B S75-S86 S107B = cherrymx:CHERRY-MX: Cherry MX series keyswitch
S87-S110 = cherrymx:CHERRY-MX-4P
SV2 = con-lsta:FE06-1: FEMALE HEADER; OC_FARNELL: unknown; OC_NEWARK: unknown
SV3 = con-lsta:FE07-1: FEMALE HEADER; OC_FARNELL: unknown; OC_NEWARK: unknown